# EAGLE design AnimeGun-v1 (EAGLE 9.2.0)

## Sheet 1 of 2
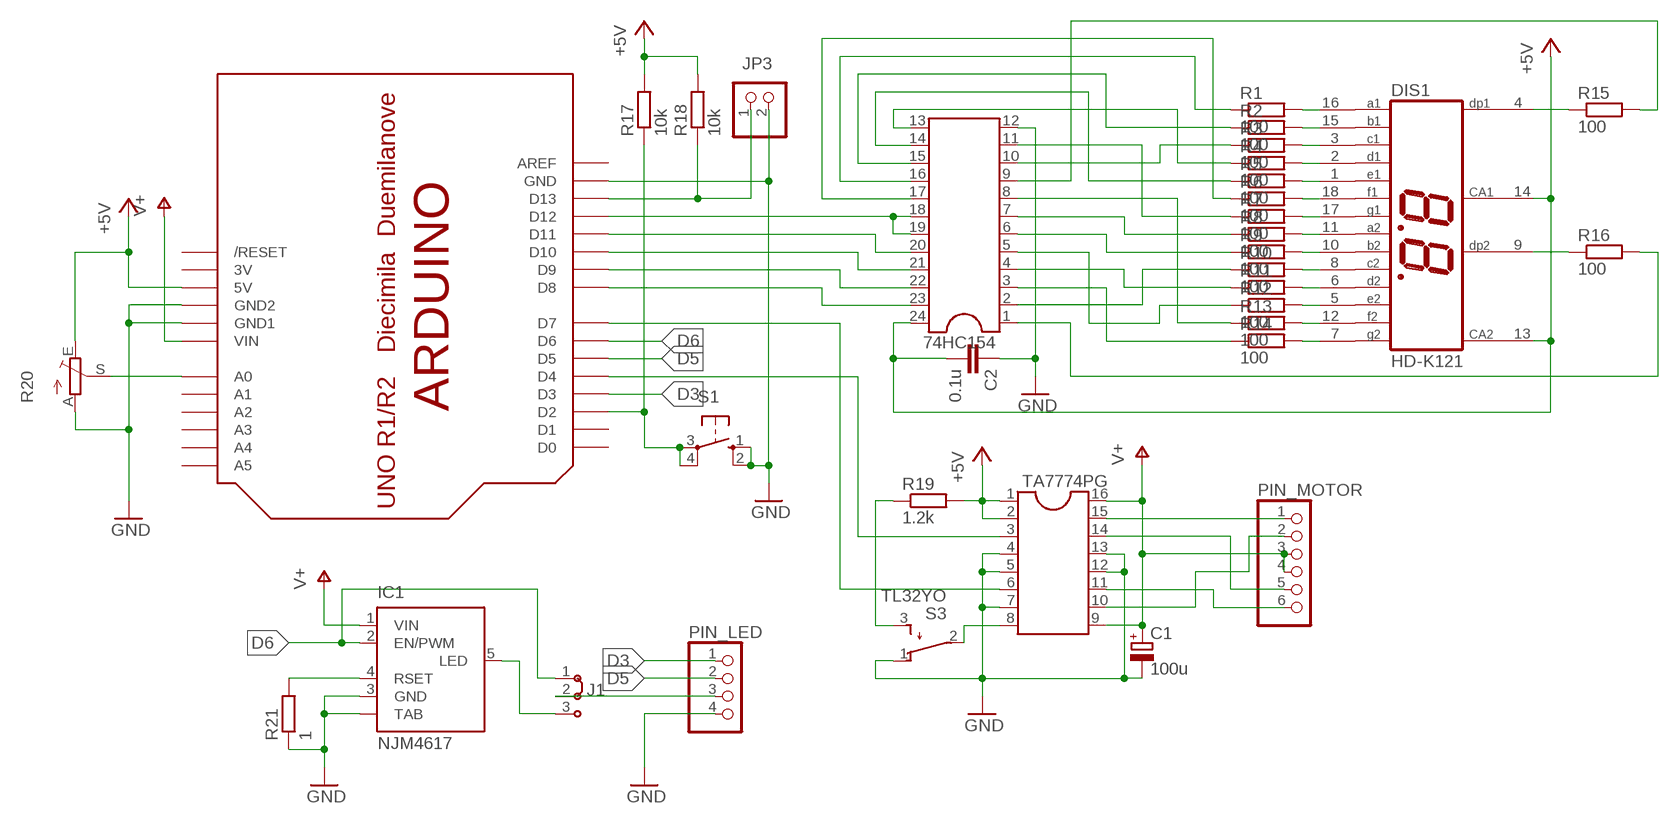
[diagram p0: schematic, sheet 1]

### Parts
74HC154  DIL24-3  [DIL24-3]
C1  100u  CPOL-EU153CLV-0605  [153CLV-0605]
C2  0.1u  C-EUC0603  [C0603]
DIS1  HD-K121  [HDSP-R]
IC1  NJM4617  [TO263_5]
J1  J2X2MM  [04C]
JP3  PINHD-1X2  [1X02]
PIN_LED  PINHD-1X4/90  [1X04/90]
PIN_MOTOR  PINHD-1X6/90  [1X06/90]
R1  100  R-EU_R0603  [R0603]
R2  100  R-EU_R0603  [R0603]
R3  100  R-EU_R0603  [R0603]
R4  100  R-EU_R0603  [R0603]
R5  100  R-EU_R0603  [R0603]
R6  100  R-EU_R0603  [R0603]
R7  100  R-EU_R0603  [R0603]
R8  100  R-EU_R0603  [R0603]
R9  100  R-EU_R0603  [R0603]
R10  100  R-EU_R0603  [R0603]
R11  R-EU_R0603  [R0603]
R12  100  R-EU_R0603  [R0603]
R13  100  R-EU_R0603  [R0603]
R14  100  R-EU_R0603  [R0603]
R15  100  R-EU_R0603  [R0603]
R16  100  R-EU_R0603  [R0603]
R17  10k  R-EU_R0603  [R0603]
R18  10k  R-EU_R0603  [R0603]
R19  1.2k  R-EU_R0603  [R0603]
R20  TRIM_EU-B25U  [B25U]
R21  1  R-EU_R0603  [R0603]
S1  10-XX  [B3F-10XX]
S3  TL32YO  [TL3XYO]
TA7774PG  DIL16  [DIL16]
U1  ARDUINO-NOHOLE  [ARDUINO-NOHOLE]

### Nets
+5V: 74HC154.24 C2.2 DIS1.13(CA2) DIS1.14(CA1) R17.2 R18.2 R19.2 R20.E TA7774PG.1 TA7774PG.2 U1.5V
D3: PIN_LED.1 U1.D3
D5: PIN_LED.2 U1.D5
D6: IC1.2(EN/PWM) J1.1 U1.D6
GND: 74HC154.12 C1.- C2.1 IC1.3(GND) IC1.TAB JP3.2 PIN_LED.4 R20.A R21.1 S1.1(S) S1.2(S1) S3.1(O) TA7774PG.4 TA7774PG.5 TA7774PG.7 TA7774PG.12 TA7774PG.13 U1.GND U1.GND1 U1.GND2
N$1: R17.1 S1.3(P) S1.4(P1) U1.D2
N$2: DIS1.16(A1) R1.2
N$3: DIS1.15(B1) R2.2
N$4: DIS1.3(C1) R3.2
N$5: DIS1.2(D1) R4.2
N$6: DIS1.1(E1) R5.2
N$7: DIS1.18(F1) R6.2
N$8: DIS1.17(G1) R7.2
N$9: DIS1.11(A2) R8.2
N$10: DIS1.10(B2) R9.2
N$11: DIS1.8(C2) R10.2
N$12: DIS1.6(D2) R11.2
N$13: DIS1.5(E2) R12.2
N$14: DIS1.12(F2) R13.2
N$15: DIS1.7(G2) R14.2
N$16: DIS1.4(DP1) R15.1
N$17: DIS1.9(DP2) R16.1
N$18: 74HC154.1 R16.2
N$19: 74HC154.2 R10.1
N$20: 74HC154.3 R14.1
N$21: 74HC154.4 R11.1
N$22: 74HC154.5 R12.1
N$23: 74HC154.6 R9.1
N$24: 74HC154.7 R8.1
N$25: 74HC154.8 R13.1
N$26: 74HC154.9 R15.2
N$27: 74HC154.10 R3.1
N$28: 74HC154.11 R7.1
N$29: 74HC154.13 R4.1
N$30: 74HC154.14 R5.1
N$31: 74HC154.15 R2.1
N$32: 74HC154.16 R1.1
N$33: 74HC154.17 R6.1
N$34: 74HC154.18 74HC154.19 U1.D12
N$35: TA7774PG.6 U1.D7
N$36: 74HC154.20 U1.D11
N$37: 74HC154.21 U1.D10
N$38: 74HC154.22 U1.D9
N$39: 74HC154.23 U1.D8
N$40: TA7774PG.3 U1.D4
N$41: JP3.1 R18.1 U1.D13
N$42: S3.2(P) TA7774PG.8
N$43: PIN_MOTOR.6 TA7774PG.11
N$44: PIN_MOTOR.1 TA7774PG.15
N$45: PIN_MOTOR.5 TA7774PG.14
N$46: PIN_MOTOR.2 TA7774PG.10
N$47: R19.1 S3.3(S)
N$48: R20.S U1.A0
N$49: IC1.4(RSET) R21.2
N$50: J1.2 PIN_LED.3
N$51: IC1.5(LED) J1.3
V+: C1.+ IC1.1(VIN) PIN_MOTOR.3 PIN_MOTOR.4 TA7774PG.9 TA7774PG.16 U1.VIN
Unconnected: U1.A1 U1.A2 U1.A3 U1.A4 U1.A5 U1.AREF U1.D0 U1.D1 U1.RESET(/RESET)

## Sheet 2 of 2
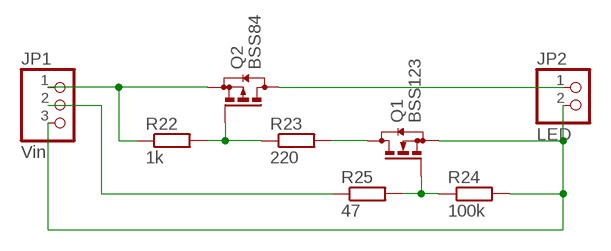
[diagram p1: schematic, sheet 2]

### Parts
JP1  Vin  PINHD-1X3  [1X03]
JP2  LED  PINHD-1X2  [1X02]
Q1  BSS123  [SOT23]
Q2  BSS84  [SOT23]
R22  1k  R-EU_R2512  [R2512]
R23  220  R-EU_R2512  [R2512]
R24  100k  R-EU_R0603  [R0603]
R25  47  R-EU_R0603  [R0603]

### Nets
N$52: Q2.1(G) R22.2 R23.1
N$53: JP1.1 Q2.2(S) R22.1
N$54: Q1.3(D) R23.2
N$55: JP2.1 Q2.3(D)
N$56: Q1.1(G) R24.1 R25.2
N$57: JP1.3 JP2.2 Q1.2(S) R24.2
N$59: JP1.2 R25.1

## Power pins joined to a net without a drawn wire
3V: U1.3V

## Library data of the parts
74HC154 = ic-package:DIL24: Dual In Line
C1 = rcl:CPOL-EU: POLARIZED CAPACITOR, European symbol; SPICEPREFIX: C
C2 = rcl:C-EU: CAPACITOR, European symbol; SPICEPREFIX: C
DIS1 = display-hp:HD-K121: LED DISPLAY 2 x 1 character 7 segment, decimal points right; OC_FARNELL: unknown; OC_NEWARK: unknown
IC1 = revetro-parts:NJM4617: 1A Constant-Current LED Driver with PWM Dimming Source: ON Semiconductor .. 4101.pdf; MPN: CAT4101TV-T75; OC_FARNELL: 1718452; OC_NEWARK: 08R5264
J1 = jumper:J2: Jumper switch 2 x 2.5 mm
JP1 = pinhead:PINHD-1X3: PIN HEADER
JP2 JP3 = pinhead:PINHD-1X2: PIN HEADER
PIN_LED = pinhead:PINHD-1X4: PIN HEADER
PIN_MOTOR = pinhead:PINHD-1X6: PIN HEADER
Q1 = transistor-small-signal:BSS123: N-CHANNEL MOS FET
Q2 = transistor-small-signal:BSS84: P-CHANNEL MOS FET
R1-R19 R21-R25 = rcl:R-EU_: RESISTOR, European symbol; SPICEPREFIX: R
R20 = pot:TRIM_EU-: POTENTIOMETER
S1 = switch-omron:10-XX: OMRON SWITCH; MPN: B3F-1000; OC_FARNELL: 176432; OC_NEWARK: 36M3542
S3 = switch:TL32YO: TINY SWITCH ON - MOM Source: http://www2.produktinfo.conrad.com/datenblaetter/700000-724999/705152-da-01-de-Subminiaturschalter_TL_36YO.pdf
TA7774PG = ic-package:DIL16: Dual In Line / Socket
U1 = adafruit:ARDUINO: Arduino Diecimila/Duemilanove Make a shield with ease, this package has all the named pins as well as the two mounting drill holes and an outline of the USB and DC power connector. The outline is on the DIMENSION layer, so if your board house uses it they will cut the outline to match. http://www.ladyada.net/library/pcb/eaglelibrary.html

## Board
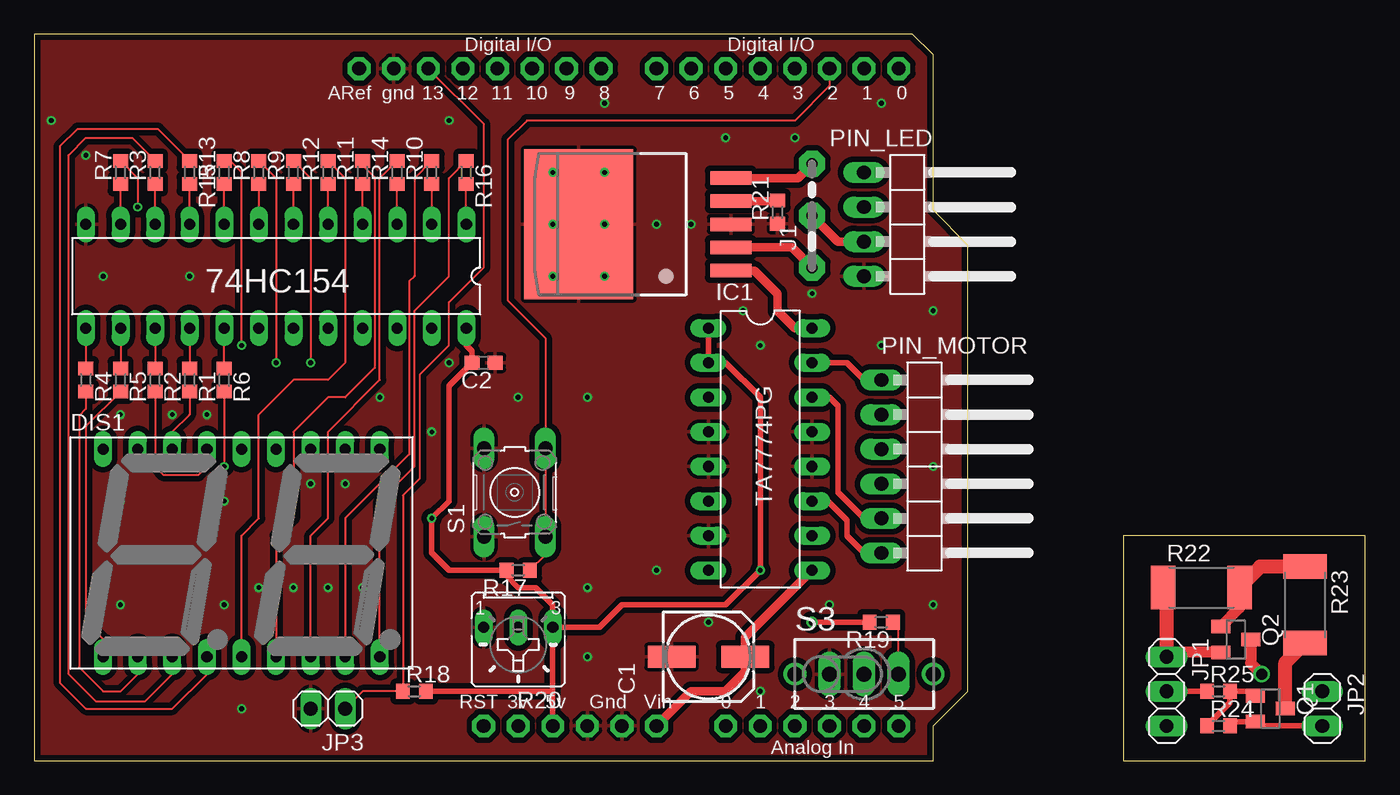
[diagram p2: board, top side]
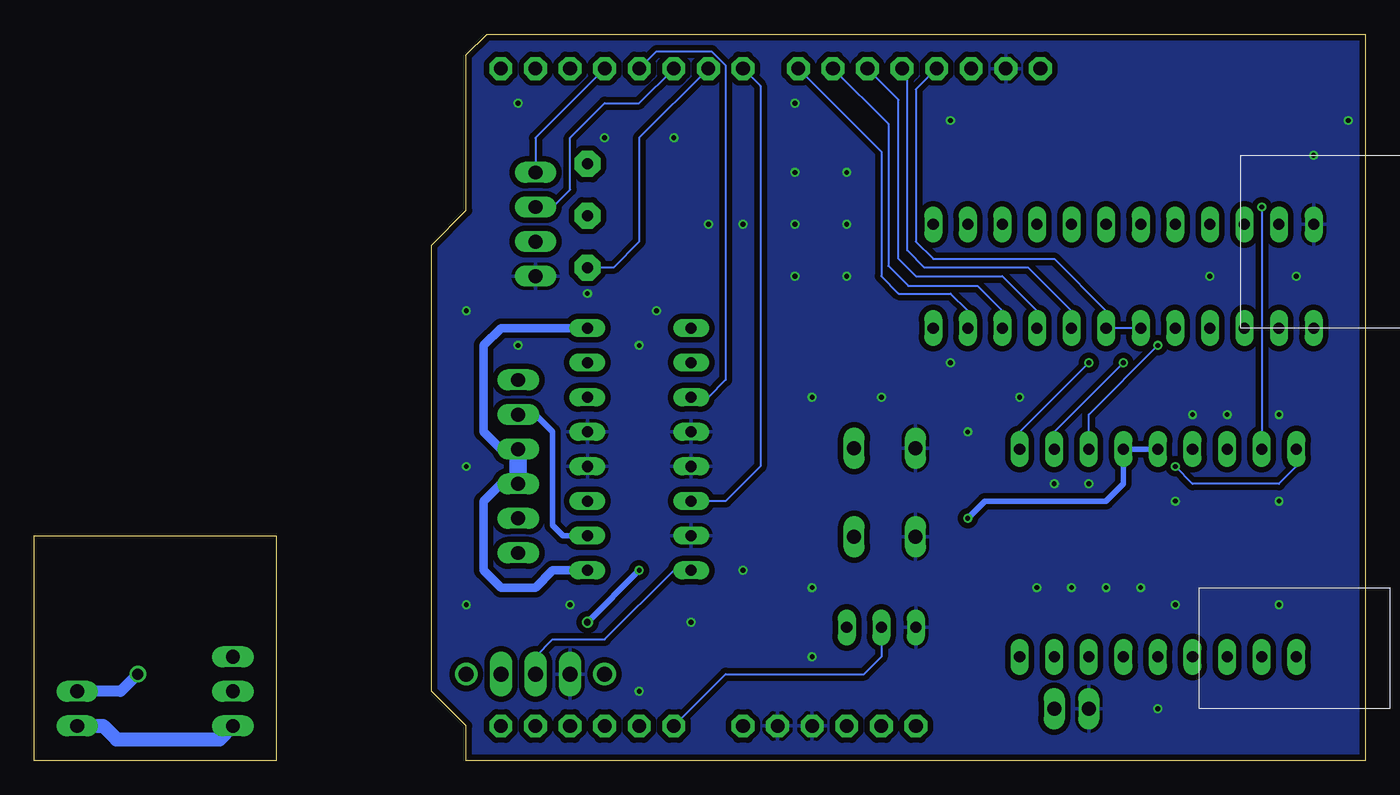
[diagram p3: board, bottom side, seen from below]

Size 97.79 x 53.34 mm. Coordinates in mm from the lower left corner, seen from the top.
Outline: 0,0 66.04,0 66.04,2.54 68.58,5.08 68.58,37.85 66.04,40.39 66.04,51.82 64.52,53.34 0,53.34 0,0
Outline: 80.01,0 97.79,0 97.79,16.51 80.01,16.51 80.01,0
Copper layers (1*16): Top 0.035mm / dielectric 1.5mm / Bottom 0.035mm
Design rules "SeeedStudio_2layer_DRU_no_angle_20140221": minimum track width 6mil, minimum drill 12mil, track to track 6mil, track to pad 6mil, pad to pad 6mil, via to via 6mil, smd to smd 0mil, copper to edge 10mil, drill to drill 10mil, minimum pad ring 10mil, minimum via ring 6mil, stop-mask expansion 2mil, vias tented up to drill 100mil, thermal gap 10mil

### Footprints (pad centres in the part's own frame; a part is rotated, then mirrored left to right if it is on the bottom)
DIL24-3 = drill 0.813 long: 1 -13.97,-3.81; 2 -11.43,-3.81; 3 -8.89,-3.81; 4 -6.35,-3.81; 5 -3.81,-3.81; 6 -1.27,-3.81; 7 1.27,-3.81; 8 3.81,-3.81; 9 6.35,-3.81; 10 8.89,-3.81; 11 11.43,-3.81; 12 13.97,-3.81; 13 13.97,3.81; 14 11.43,3.81; 15 8.89,3.81; 16 6.35,3.81; 17 3.81,3.81; 18 1.27,3.81; 19 -1.27,3.81; 20 -3.81,3.81; 21 -6.35,3.81; 22 -8.89,3.81; 23 -11.43,3.81; 24 -13.97,3.81
153CLV-0605 = smd 3.5 x 1.6: + 2.7,0; - -2.7,0
C0603 = smd 1.1 x 1: 1 -0.85,0; 2 0.85,0
HDSP-R = drill 0.813 long: 1 -10.16,-7.62; 2 -7.62,-7.62; 3 -5.08,-7.62; 4 -2.54,-7.62; 5 0,-7.62; 6 2.54,-7.62; 7 5.08,-7.62; 8 7.62,-7.62; 9 10.16,-7.62; 10 10.16,7.62; 11 7.62,7.62; 12 5.08,7.62; 13 2.54,7.62; 14 0,7.62; 15 -2.54,7.62; 16 -5.08,7.62; 17 -7.62,7.62; 18 -10.16,7.62
TO263_5 = smd 1 x 3: 1 -3.4,-8; 2 -1.7,-8; 3 0,-8; 4 1.7,-8; 5 3.4,-8 | smd 11 x 8: TAB 0,3.175
04C = drill 0.813 pad 1.905 octagon: 1 -1.905,0; 2 1.905,0; 3 5.715,0
1X03 = drill 1.016 long: 1 -2.54,0; 2 0,0; 3 2.54,0
1X02 = drill 1.016 long: 1 -1.27,0; 2 1.27,0
1X04/90 = drill 1.016 long: 1 -3.81,-3.81; 2 -1.27,-3.81; 3 1.27,-3.81; 4 3.81,-3.81
1X06/90 = drill 1.016 long: 1 -6.35,-3.81; 2 -3.81,-3.81; 3 -1.27,-3.81; 4 1.27,-3.81; 5 3.81,-3.81; 6 6.35,-3.81
SOT23 = smd 1 x 1.4: 1 -0.95,-1.1; 2 0.95,-1.1; 3 0,1.1
R0603 = smd 1 x 1.1: 1 -0.85,0; 2 0.85,0
B25U = drill 0.813 long: A 2.54,-0.889; E -2.54,-0.889; S 0,-0.889
R2512 = smd 1.8 x 3.2: 1 -2.8,0; 2 2.8,0
B3F-10XX = drill 1.016 long: 1 -3.251,2.261; 2 3.251,2.261; 3 -3.251,-2.261; 4 3.251,-2.261
TL3XYO = drill 1.1 pad 1.422 long: 1 -2.54,0; 2 0,0; 3 2.54,0 | drill 1.1 pad 1.676: M1 -5.08,0; M2 5.08,0
DIL16 = drill 0.813 long: 1 -8.89,-3.81; 2 -6.35,-3.81; 3 -3.81,-3.81; 4 -1.27,-3.81; 5 1.27,-3.81; 6 3.81,-3.81; 7 6.35,-3.81; 8 8.89,-3.81; 9 8.89,3.81; 10 6.35,3.81; 11 3.81,3.81; 12 1.27,3.81; 13 -1.27,3.81; 14 -3.81,3.81; 15 -6.35,3.81; 16 -8.89,3.81
ARDUINO-NOHOLE = drill 1 pad 1.676 octagon: 3V 35.56,2.54; 5V 38.1,2.54; A0 50.8,2.54; A1 53.34,2.54; A2 55.88,2.54; A3 58.42,2.54; A4 60.96,2.54; A5 63.5,2.54; AREF 23.876,50.8; D0 63.5,50.8; D1 60.96,50.8; D2 58.42,50.8; D3 55.88,50.8; D4 53.34,50.8; D5 50.8,50.8; D6 48.26,50.8; D7 45.72,50.8; D8 41.656,50.8; D9 39.116,50.8; D10 36.576,50.8; D11 34.036,50.8; D12 31.496,50.8; D13 28.956,50.8; GND 26.416,50.8; GND1 43.18,2.54; GND2 40.64,2.54; RESET 33.02,2.54; VIN 45.72,2.54

### Placement (x,y rotation side)
74HC154  17.78,35.56 180 top
C1  49.53,7.62 0 top
C2  33.02,29.21 180 top
DIS1  15.24,15.24 0 top
IC1  43.18,39.37 90 top
J1  57.15,38.1 90 top
JP1  83.19,5.08 270 top
JP2  94.61,3.81 270 top
JP3  21.59,3.81 180 top
PIN_LED  64.77,39.37 270 top
PIN_MOTOR  66.04,21.59 270 top
Q1  90.81,3.81 270 top
Q2  88.27,8.89 270 top
R1  11.43,27.94 270 top
R2  8.89,27.94 270 top
R3  8.89,43.18 90 top
R4  3.81,27.94 270 top
R5  6.35,27.94 270 top
R6  13.97,27.94 270 top
R7  6.35,43.18 90 top
R8  16.51,43.18 90 top
R9  19.05,43.18 90 top
R10  29.21,43.18 90 top
R11  24.13,43.18 90 top
R12  21.59,43.18 90 top
R13  13.97,43.18 90 top
R14  26.67,43.18 90 top
R15  11.43,43.18 270 top
R16  31.75,43.18 270 top
R17  35.56,13.97 180 top
R18  27.94,5.08 0 top
R19  62.23,10.16 180 top
R20  35.56,8.89 180 top
R21  54.61,40.26 90 top
R22  85.72,12.7 0 top
R23  93.34,11.43 270 top
R24  87,2.54 0 top
R25  87,5.08 0 top
S1  35.31,19.68 90 top
S3  60.96,6.35 0 top
TA7774PG  53.34,22.86 270 top
U1  0,0 0 top

### Tracks (layer width: path | path; a pad name or v marks a point on that pad's centre or on a via)
+5V  (via drill 0.35, 0.5)
  Top 0.406: U1.5V 38.1,5.08 | 38.1,5.08 R20.E | R20.E 38.1,11.43 36.83,12.7 35.56,12.7 34.71,13.55 R17.2 30.48,13.97 29.21,15.24 v29.21,17.78 30.48,19.05 30.48,27.52 C2.2 32.17,30.06 31.75,30.48 74HC154.24 | TA7774PG.1 TA7774PG.2 50.8,29.21 53.34,26.67 v53.34,13.97 50.8,11.43 43.18,11.43 41.53,9.78 R20.E | v57.15,10.16 R19.2 | 38.1,5.08 R18.2
  Bottom 0.406: v57.15,10.16 v53.34,13.97 | DIS1.14 DIS1.13 17.78,20.32 19.05,19.05 27.94,19.05 v29.21,17.78
D3
  Bottom 0.152: U1.D3 60.96,45.72 PIN_LED.1
D5
  Bottom 0.152: PIN_LED.2 59.69,40.64 58.42,41.91 58.42,45.72 55.88,48.26 53.34,48.26 U1.D5
D6
  Top 0.61: IC1.2 55.67,37.67 J1.1
  Bottom 0.152: U1.D6 53.34,45.72 53.34,38.1 55.24,36.2 J1.1
GND  (via drill 0.35)
  other vias: 3.81,44.45 11.43,35.56 5.08,35.56 1.27,46.99 6.35,25.4 12.7,25.4 10.16,25.4 6.35,11.43 6.35,19.05 13.97,19.05 13.97,11.43 16.51,12.7 19.05,12.7 21.59,12.7 24.13,12.7 20.32,20.32 22.86,20.32 25.4,26.67 38.1,43.18 41.91,43.18 41.91,35.56 38.1,35.56 38.1,39.37 41.91,39.37 30.48,46.99 41.91,48.26 50.8,45.72 55.88,45.72 62.23,48.26 40.64,12.7 40.64,26.67 35.56,26.67 40.64,7.62 49.53,10.16 45.72,13.97 58.42,11.43 53.34,5.08 66.04,11.43 66.04,21.59 66.04,33.02 62.23,30.48 52.07,33.02 45.72,39.37 48.26,39.37 53.34,30.48 15.24,3.81 57.15,34.29 30.48,29.21 29.21,24.13
  pour Top (isolate 0.406): 0,53.34 0,0 66.04,0 66.04,2.54 68.58,5.08 68.58,38.1 66.04,40.64 66.04,52.07 64.77,53.34
  pour Bottom (isolate 0.406): 0,53.34 0,0 66.04,0 66.04,2.54 68.58,5.08 68.58,38.1 66.04,40.64 66.04,52.07 64.77,53.34
N$1
  Top 0.152: U1.D2 58.42,49.53 55.88,46.99 36.2,46.99 34.8,45.59 34.8,33.78 37.57,31.01 S1.4 S1.3 37.57,15.13 R17.1
N$2
  Top 0.152: R1.2 11.43,25.4 10.16,24.13 DIS1.16
N$3
  Top 0.152: R2.2 8.89,21.59 9.53,20.95 12.06,20.95 12.7,21.59 DIS1.15
N$4
  Top 0.152: R3.2 7.2,45.72 3.81,45.72 2.54,44.45 2.54,6.35 4.57,4.32 8.13,4.32 10.16,6.35 DIS1.3
N$5
  Top 0.152: R4.2 3.81,25.82 3.3,25.31 3.3,6.86 5.08,5.08 6.35,5.08 7.62,6.35 DIS1.2
N$6
  Top 0.152: R5.2 3.81,24.55 3.81,10.16 5.08,8.89 DIS1.1
N$7  (via drill 0.35)
  Top 0.152: R6.2 v13.97,21.59
  Bottom 0.152: DIS1.18 5.08,21.59 6.35,20.32 12.7,20.32 v13.97,21.59
N$8  (via drill 0.35)
  Top 0.152: R7.2 7.62,42.76 v7.62,40.64
  Bottom 0.152: v7.62,40.64 DIS1.17
N$9  (via drill 0.35)
  Top 0.152: R8.2 17.78,42.76 v17.78,29.21
  Bottom 0.152: v17.78,29.21 22.86,24.13 DIS1.11
N$10  (via drill 0.35)
  Top 0.152: R9.2 20.32,42.76 v20.32,29.21
  Bottom 0.152: v20.32,29.21 25.4,24.13 DIS1.10
N$11
  Top 0.152: R10.2 27.94,42.76 27.94,35.56 27.56,35.18 27.56,22.48 22.86,17.78 DIS1.8
N$12
  Top 0.152: R11.2 24.13,43.7 25.02,42.81 25.02,28.83 22.86,26.67 21.59,26.67 19.05,24.13 19.05,17.78 17.78,16.51 DIS1.6
N$13
  Top 0.152: R12.2 22.86,42.76 22.86,29.21 21.59,27.94 19.05,27.94 16.51,25.4 16.51,17.78 15.24,16.51 DIS1.5
N$14  (via drill 0.35)
  Top 0.152: R13.2 14.39,44.03 15.24,43.18 v15.24,30.48
  Bottom 0.152: DIS1.12 20.32,25.4 v15.24,30.48
N$15
  Top 0.152: R14.2 25.4,42.76 25.4,27.94 21.59,24.13 21.59,17.78 20.32,16.51 DIS1.7
N$16
  Top 0.152: R15.1 9.11,46.35 3.17,46.35 1.91,45.09 1.91,5.71 3.81,3.81 10.16,3.81 12.7,6.35 DIS1.4
N$17
  Top 0.152: R16.1 30.48,42.76 30.48,35.56 27.94,33.02 27.94,21.59 25.4,19.05 DIS1.9
N$18
  Top 0.152: 74HC154.1 R16.2
N$19
  Top 0.152: R10.1 74HC154.2
N$20
  Top 0.152: 74HC154.3 R14.1
N$21
  Top 0.152: 74HC154.4 R11.1
N$22
  Top 0.152: 74HC154.5 R12.1
N$23
  Top 0.152: 74HC154.6 R9.1
N$24
  Top 0.152: R8.1 74HC154.7
N$25
  Top 0.152: 74HC154.8 R13.1
N$26
  Top 0.152: 74HC154.9 R15.2
N$27
  Top 0.152: 74HC154.10 R3.1
N$28
  Top 0.152: 74HC154.11 R7.1
N$29
  Top 0.152: 74HC154.13 R4.1
N$30
  Top 0.152: 74HC154.14 R5.1
N$31
  Top 0.152: 74HC154.15 R2.1
N$32
  Top 0.152: 74HC154.16 R1.1
N$33
  Top 0.152: R6.1 74HC154.17
N$34
  Bottom 0.152: U1.D12 33.02,49.28 33.02,38.1 31.75,36.83 22.86,36.83 19.05,33.02 74HC154.19 74HC154.18
N$35
  Bottom 0.152: U1.D7 44.45,49.53 44.45,21.59 46.99,19.05 TA7774PG.6
N$36
  Bottom 0.152: 74HC154.20 21.59,33.02 24.77,36.2 32.38,36.2 33.66,37.47 33.66,50.42 U1.D11
N$37
  Bottom 0.152: 74HC154.21 24.13,33.02 26.67,35.56 33.02,35.56 34.29,36.83 34.29,48.51 U1.D10
N$38
  Bottom 0.152: U1.D9 35.05,46.74 35.05,36.32 33.58,34.85 28.5,34.85 26.67,33.02 74HC154.22
N$39
  Bottom 0.152: U1.D8 35.56,44.7 35.56,35.56 34.29,34.29 30.48,34.29 29.21,33.02 74HC154.23
N$40
  Bottom 0.152: U1.D4 52.07,52.07 48.02,52.07 46.99,51.04 46.99,27.94 48.26,26.67 TA7774PG.3
N$41
  Top 0.152: JP3.1 24.13,5.08 R18.1 27.09,19.47 28.32,20.7 28.32,28.32 30.48,30.48 30.48,33.66 33.02,36.2 33.02,46.74 U1.D13
N$42
  Bottom 0.152: S3.2 60.96,7.62 59.69,8.89 55.88,8.89 50.8,13.97 TA7774PG.8
N$43
  Top 0.406: PIN_MOTOR.6 60.96,15.24 59.69,16.51 59.69,17.65 58.29,19.05 TA7774PG.11
N$44
  Top 0.406: PIN_MOTOR.1 60.96,27.94 59.69,29.21 TA7774PG.15
N$45
  Top 0.406: TA7774PG.14 58.42,26.67 59.05,26.04 59.05,19.68 60.96,17.78 PIN_MOTOR.5
N$46
  Bottom 0.406: TA7774PG.10 58.93,16.51 59.69,17.27 59.69,24.13 60.96,25.4 PIN_MOTOR.2
N$47
  Top 0.152: S3.3 63.5,9.74 R19.1
N$48
  Bottom 0.152: R20.S 35.56,7.62 36.83,6.35 46.99,6.35 U1.A0
N$49
  Top 0.61: R21.2 54.57,41.07 IC1.4
N$50
  Top 0.61: J1.2 59.05,38.1 PIN_LED.3
N$51
  Top 0.61: J1.3 56.1,42.77 IC1.5
N$52
  Top 0.813: R22.2 88.53,11.2 Q2.1
  Top 1.016: R23.1 90.06,14.23 R22.2
N$53
  Top 0.813: Q2.2 83.5,7.94 JP1.1
  Top 1.016: JP1.1 83.19,12.44 R22.1
N$54
  Top 1.016: Q1.3 91.91,7.19 R23.2
N$55  (via drill 0.8)
  Top 0.813: Q2.3 89.36,7.16 v90.17,6.35
  Bottom 0.813: v90.17,6.35 91.44,5.08 JP2.1
N$56
  Top 0.406: Q1.1 89.39,5.08 R25.2 87.84,4.24 R24.1
N$57
  Top 0.406: R24.2 88.17,2.86 Q1.2 90.03,2.54 JP2.2
  Bottom 1.016: JP2.2 92.71,2.54 91.73,1.56 84.16,1.56 JP1.3
N$59
  Top 0.406: JP1.2 R25.1
V+
  Top 0.61: IC1.1 52.93,35.97 54.61,34.29 54.61,33.02 55.88,31.75 TA7774PG.16 | U1.VIN 48.26,5.08 50.8,5.08 52.23,6.51 C1.+ 52.23,9.05 TA7774PG.9
  Bottom 0.61: TA7774PG.16 63.5,31.75 64.77,30.48 64.77,24.13 63.5,22.86 PIN_MOTOR.3 | TA7774PG.9 59.69,13.97 60.96,12.7 63.5,12.7 64.77,13.97 64.77,19.05 63.5,20.32 PIN_MOTOR.4
  Bottom 1.27: PIN_MOTOR.3 PIN_MOTOR.4